# Altium schematic sheet top_level.SchDoc
size A3; SheetNumber: 2; SheetTotal: 15
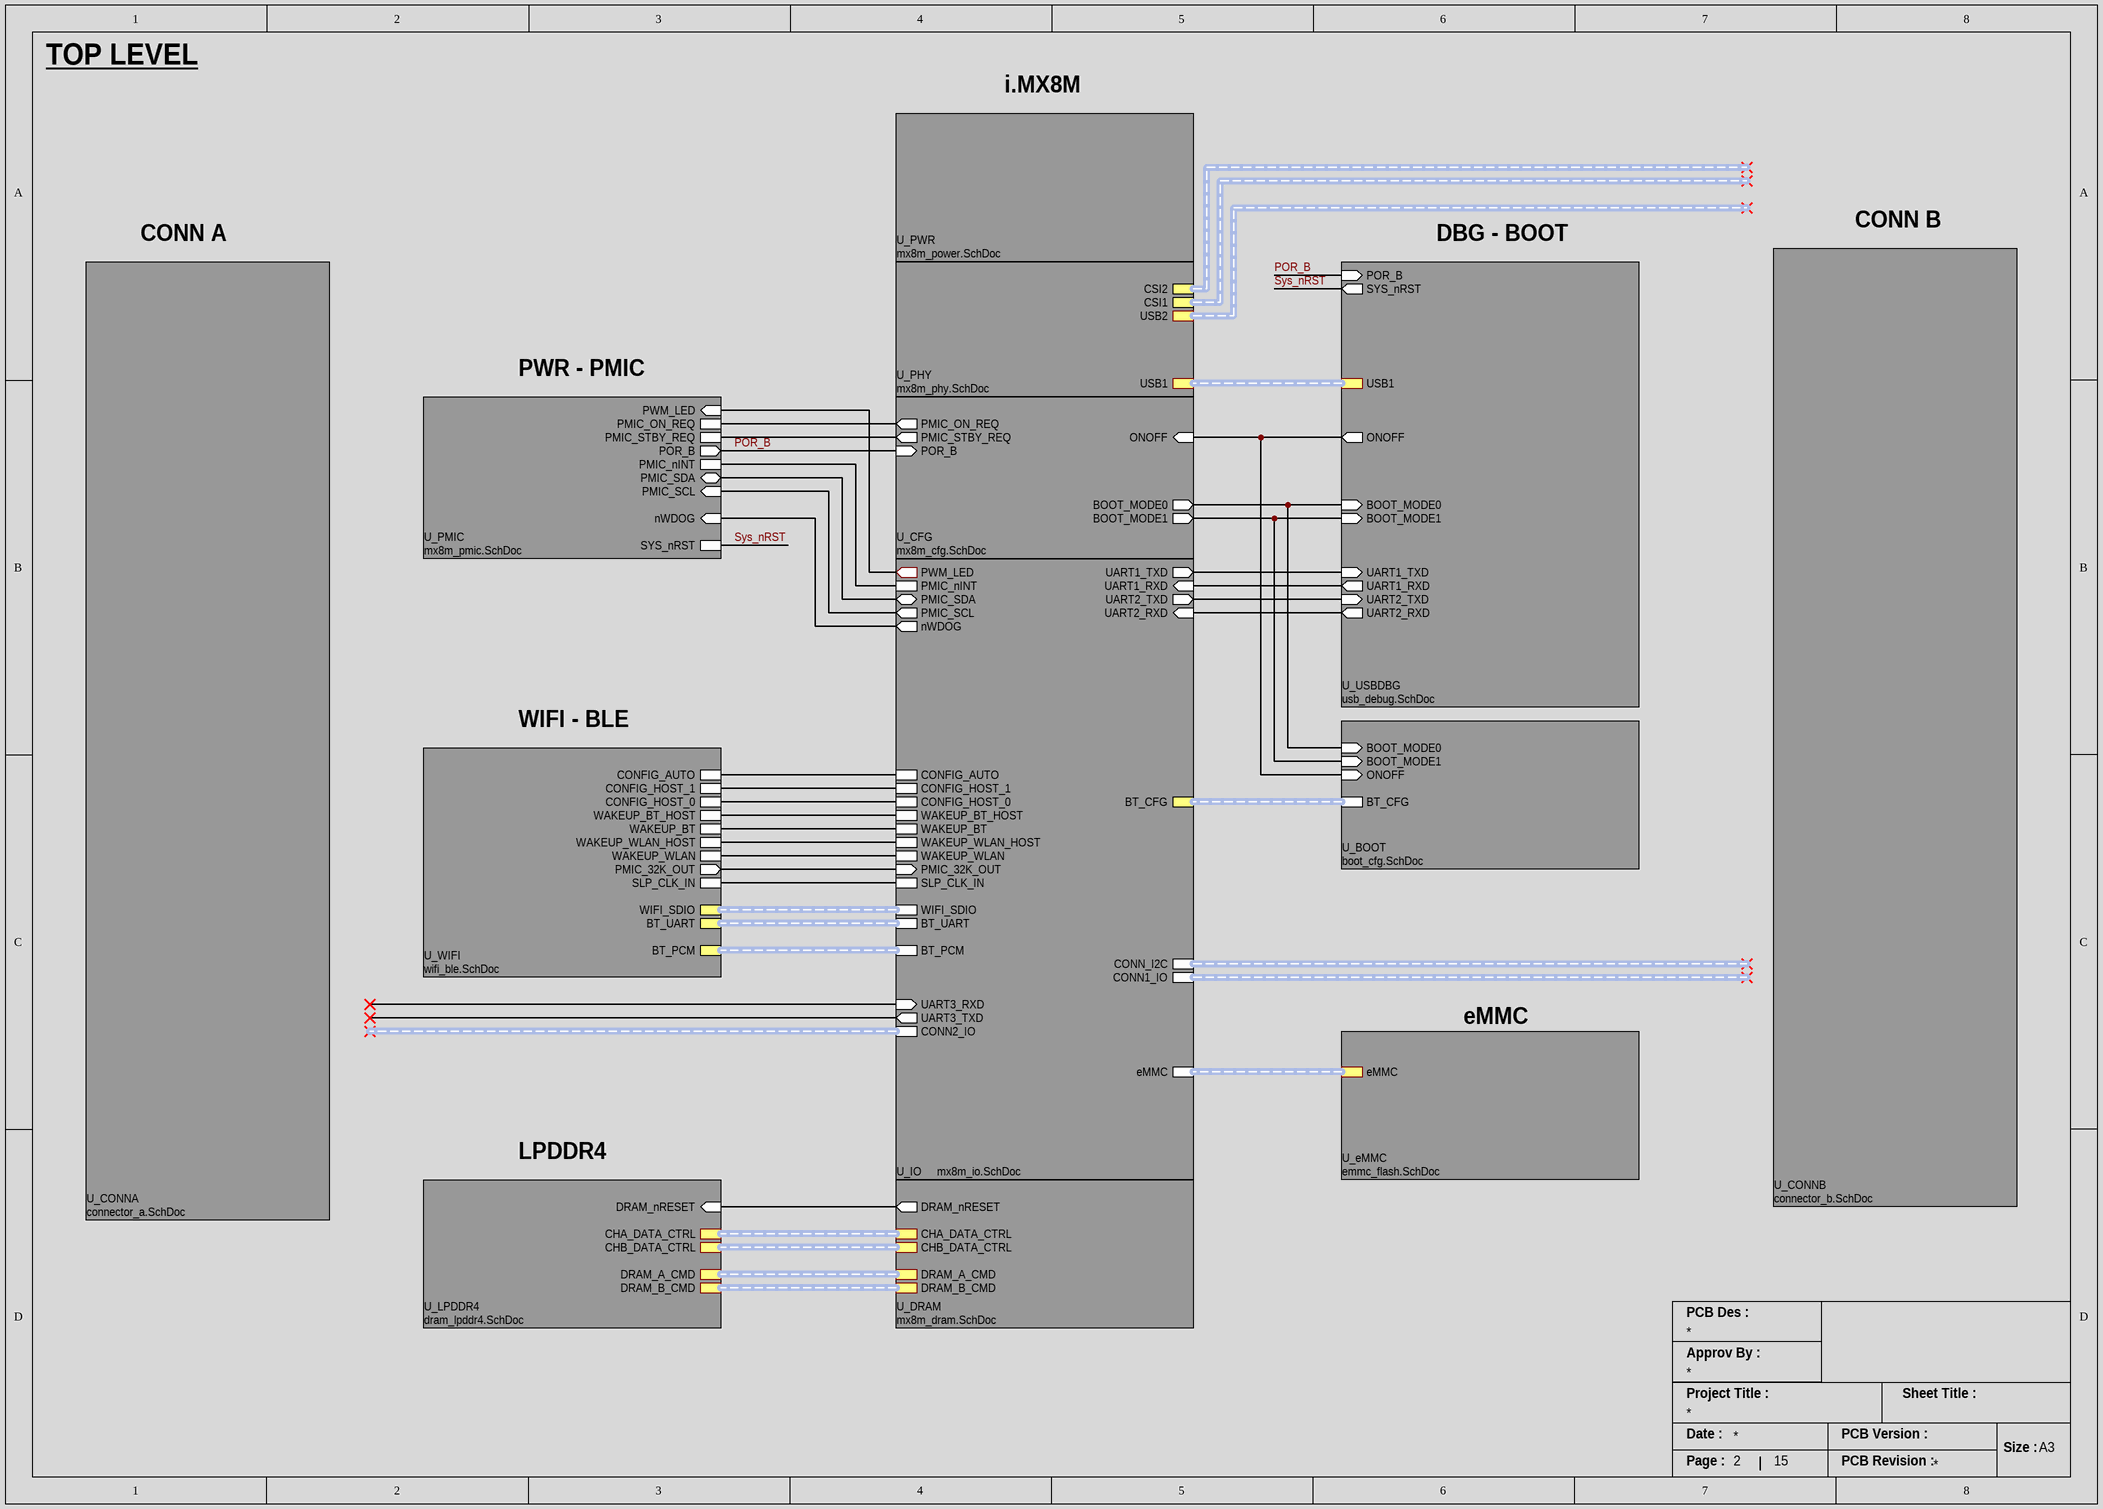
[diagram p0: top_level.SchDoc]

## Sub-sheets
U_BOOT = boot_cfg.SchDoc: BT_CFG (harness BT_CFG), BOOT_MODE1 (in), BOOT_MODE0 (in), ONOFF (in)
U_CFG = mx8m_cfg.SchDoc: POR_B (in), BOOT_MODE0 (out), BOOT_MODE1 (out), PMIC_STBY_REQ (out), PMIC_ON_REQ (out), ONOFF (in)
U_CONNA = connector_a.SchDoc: no entries
U_CONNB = connector_b.SchDoc: no entries
U_DRAM = mx8m_dram.SchDoc: DRAM_A_CMD (harness DRAM_A_CMD), DRAM_B_CMD (harness DRAM_B_CMD), CHA_DATA_CTRL (harness CHA_DATA_CTRL), CHB_DATA_CTRL (harness CHB_DATA_CTRL), DRAM_nRESET (out)
U_eMMC = emmc_flash.SchDoc: eMMC (harness eMMC)
U_IO = mx8m_io.SchDoc: PMIC_SCL (out), PMIC_SDA (bidir), WIFI_SDIO (harness WIFI_SDIO), BT_UART (harness BT_UART), eMMC (harness eMMC), BT_PCM (harness BT_PCM), WAKEUP_WLAN_HOST, WAKEUP_WLAN, WAKEUP_BT_HOST, WAKEUP_BT, SLP_CLK_IN, CONFIG_HOST_0, CONFIG_HOST_1, CONFIG_AUTO, PWM_LED (out), PMIC_nINT, nWDOG (out), UART2_RXD (in), UART2_TXD (out), UART1_RXD (in), UART1_TXD (out), BT_CFG (harness BT_CFG), UART3_RXD (in), UART3_TXD (out), CONN_I2C (harness CONN_I2C), CONN1_IO (harness CONN1_IO), CONN2_IO (harness CONN2_IO), PMIC_32K_OUT (in)
U_LPDDR4 = dram_lpddr4.SchDoc: DRAM_nRESET (in), DRAM_A_CMD (harness DRAM_A_CMD), DRAM_B_CMD (harness DRAM_B_CMD), CHB_DATA_CTRL (harness CHB_DATA_CTRL), CHA_DATA_CTRL (harness CHA_DATA_CTRL)
U_PHY = mx8m_phy.SchDoc: CSI1 (harness BB_CON_CAM1), CSI2 (harness BB_CON_CAM2), USB1 (harness USB1), USB2 (harness DBG_CON_USB)
U_PMIC = mx8m_pmic.SchDoc: PWM_LED (in), PMIC_ON_REQ, POR_B (out), PMIC_STBY_REQ, PMIC_nINT, SYS_nRST, nWDOG (in), PMIC_SDA (bidir), PMIC_SCL (in)
U_PWR = mx8m_power.SchDoc: no entries
U_USBDBG = usb_debug.SchDoc: ONOFF (out), SYS_nRST (out), UART2_RXD (out), UART2_TXD (in), UART1_RXD (out), UART1_TXD (in), BOOT_MODE0 (in), BOOT_MODE1 (in), POR_B (in), USB1 (harness USB1)
U_WIFI = wifi_ble.SchDoc: WIFI_SDIO (harness WIFI_SDIO), BT_UART (harness BT_UART), BT_PCM (harness BT_PCM), WAKEUP_BT, WAKEUP_BT_HOST, PMIC_32K_OUT (out), CONFIG_AUTO, CONFIG_HOST_1, CONFIG_HOST_0, SLP_CLK_IN, WAKEUP_WLAN, WAKEUP_WLAN_HOST

## Nets
POR_B: sheet U_CFG/POR_B, sheet U_PMIC/POR_B, sheet U_USBDBG/POR_B
Sys_nRST: sheet U_PMIC/SYS_nRST, sheet U_USBDBG/SYS_nRST
(unnamed): sheet U_DRAM/DRAM_nRESET, sheet U_LPDDR4/DRAM_nRESET
(unnamed): sheet U_CFG/BOOT_MODE0, sheet U_USBDBG/BOOT_MODE0, sheet U_BOOT/BOOT_MODE0
(unnamed): sheet U_CFG/BOOT_MODE1, sheet U_USBDBG/BOOT_MODE1, sheet U_BOOT/BOOT_MODE1
(unnamed): sheet U_CFG/PMIC_STBY_REQ, sheet U_PMIC/PMIC_STBY_REQ
(unnamed): sheet U_CFG/PMIC_ON_REQ, sheet U_PMIC/PMIC_ON_REQ
(unnamed): sheet U_CFG/ONOFF, sheet U_USBDBG/ONOFF, sheet U_BOOT/ONOFF
(unnamed): sheet U_IO/PMIC_SCL, sheet U_PMIC/PMIC_SCL
(unnamed): sheet U_IO/PMIC_SDA, sheet U_PMIC/PMIC_SDA
(unnamed): sheet U_IO/WAKEUP_WLAN_HOST, sheet U_WIFI/WAKEUP_WLAN_HOST
(unnamed): sheet U_IO/WAKEUP_WLAN, sheet U_WIFI/WAKEUP_WLAN
(unnamed): sheet U_IO/WAKEUP_BT_HOST, sheet U_WIFI/WAKEUP_BT_HOST
(unnamed): sheet U_IO/WAKEUP_BT, sheet U_WIFI/WAKEUP_BT
(unnamed): sheet U_IO/SLP_CLK_IN, sheet U_WIFI/SLP_CLK_IN
(unnamed): sheet U_IO/CONFIG_HOST_0, sheet U_WIFI/CONFIG_HOST_0
(unnamed): sheet U_IO/CONFIG_HOST_1, sheet U_WIFI/CONFIG_HOST_1
(unnamed): sheet U_IO/CONFIG_AUTO, sheet U_WIFI/CONFIG_AUTO
(unnamed): sheet U_IO/PWM_LED, sheet U_PMIC/PWM_LED
(unnamed): sheet U_IO/PMIC_nINT, sheet U_PMIC/PMIC_nINT
(unnamed): sheet U_IO/nWDOG, sheet U_PMIC/nWDOG
(unnamed): sheet U_IO/UART2_RXD, sheet U_USBDBG/UART2_RXD
(unnamed): sheet U_IO/UART2_TXD, sheet U_USBDBG/UART2_TXD
(unnamed): sheet U_IO/UART1_RXD, sheet U_USBDBG/UART1_RXD
(unnamed): sheet U_IO/UART1_TXD, sheet U_USBDBG/UART1_TXD
(unnamed): sheet U_IO/PMIC_32K_OUT, sheet U_WIFI/PMIC_32K_OUT

## Buses and harness runs
harness sheet U_BOOT/BT_CFG = sheet U_IO/BT_CFG
harness sheet U_DRAM/CHA_DATA_CTRL = sheet U_LPDDR4/CHA_DATA_CTRL
harness sheet U_DRAM/CHB_DATA_CTRL = sheet U_LPDDR4/CHB_DATA_CTRL
harness sheet U_DRAM/DRAM_A_CMD = sheet U_LPDDR4/DRAM_A_CMD
harness sheet U_DRAM/DRAM_B_CMD = sheet U_LPDDR4/DRAM_B_CMD
harness sheet U_eMMC/eMMC = sheet U_IO/eMMC
harness sheet U_IO/BT_PCM = sheet U_WIFI/BT_PCM
harness sheet U_IO/BT_UART = sheet U_WIFI/BT_UART
harness sheet U_IO/WIFI_SDIO = sheet U_WIFI/WIFI_SDIO
harness sheet U_PHY/USB1 = sheet U_USBDBG/USB1

## Notes on the sheet
- TOP LEVEL
- i.MX8M
- CONN A
- DBG - BOOT
- CONN B
- PWR - PMIC
- WIFI - BLE
- eMMC
- LPDDR4
- PCB Des :
- Approv By :
- Project Title :
- Sheet Title :
- Date :
- PCB Version :
- Size :
- A3
- Page :
- PCB Revision :